# Altium schematic sheet nm_rs485_phy.SchDoc
size 209 x 297 mm; SheetNumber: 3; SheetTotal: 9
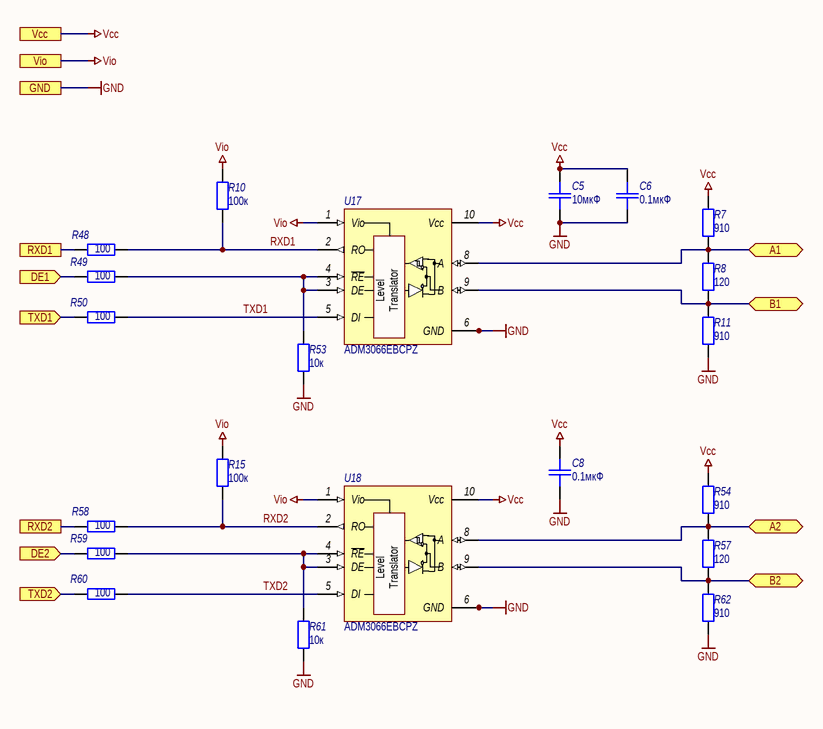
[diagram p0: nm_rs485_phy.SchDoc]

## Parts
C5  value 10мкФ  [SMD_C0603]  (hidden comment: Capacitor)
C6  value 0.1мкФ  [SMD_C0603]  (hidden comment: Capacitor)
C8  value 0.1мкФ  [SMD_C0603]  (hidden comment: Capacitor)
R7  value 910  [SMD_0603]  (hidden comment: Resistor)
R8  value 120  [SMD_0603]  (hidden comment: Resistor)
R10  value 100к  [SMD_0603]  (hidden comment: Resistor)
R11  value 910  [SMD_0603]  (hidden comment: Resistor)
R15  value 100к  [SMD_0603]  (hidden comment: Resistor)
R48  value 100  [SMD_0603]  (hidden comment: Resistor)
R49  value 100  [SMD_0603]  (hidden comment: Resistor)
R50  value 100  [SMD_0603]  (hidden comment: Resistor)
R53  value 10к  [SMD_0603]  (hidden comment: Resistor)
R54  value 910  [SMD_0603]  (hidden comment: Resistor)
R57  value 120  [SMD_0603]  (hidden comment: Resistor)
R58  value 100  [SMD_0603]  (hidden comment: Resistor)
R59  value 100  [SMD_0603]  (hidden comment: Resistor)
R60  value 100  [SMD_0603]  (hidden comment: Resistor)
R61  value 10к  [SMD_0603]  (hidden comment: Resistor)
R62  value 910  [SMD_0603]  (hidden comment: Resistor)
U17  ADM3066EBCPZ  [LFCSP-10_3x3]
U18  ADM3066EBCPZ  [LFCSP-10_3x3]

## Ports
A1 (bidir), A2 (bidir), B1 (bidir), B2 (bidir), DE1 (in), DE2 (in), GND, RXD1, RXD2, TXD1 (in), TXD2 (in), Vcc, Vio

## Nets
GND: C5.1 C6.1 C8.1 R11.1 R53.1 R61.1 R62.1 U17.6(GND) U17.11(GND) U18.6(GND) U18.11(GND) ; port GND
Vcc: C5.2 C6.2 C8.2 R7.1 R54.1 U17.10(Vcc) U18.10(Vcc) ; port Vcc
Vio: R10.1 R15.1 U17.1(Vio) U18.1(Vio) ; port Vio
A1: R7.2 R8.2 U17.8(A) ; port A1
A2: R54.2 R57.2 U18.8(A) ; port A2
B1: R8.1 R11.2 U17.9(B) ; port B1
B2: R57.1 R62.2 U18.9(B) ; port B2
DE1: R49.2 ; port DE1
DE2: R59.2 ; port DE2
RXD1: R10.2 R48.1 U17.2(RO)
RXD1: R48.2 ; port RXD1  [a separate net that carries the same name]
RXD2: R15.2 R58.1 U18.2(RO)
RXD2: R58.2 ; port RXD2  [a separate net that carries the same name]
TXD1: R50.1 U17.5(DI)
TXD1: R50.2 ; port TXD1  [a separate net that carries the same name]
TXD2: R60.1 U18.5(DI)
TXD2: R60.2 ; port TXD2  [a separate net that carries the same name]
NetR49_1: R49.1 R53.2 U17.3(DE) U17.4(~{RE})
NetR59_1: R59.1 R61.2 U18.3(DE) U18.4(~{RE})

## Notes on the sheet
- Подп. и дата
- Инв. № дубл.
- Взам. инв. №
- Инв. № подл.
- Изм.
- Лист
- № докум.
- Подп.
- Дата
- Форма 2а ГОСТ 2.104-2006
- Копировал
- Формат А4
- (in symbol ADM3066E) Level; Translator

## Library data of the parts
C5 C6 C8 = Capacitor: Назначение: SMD-конденсатор; Наименование: Конденсатор; Потребление, Вт: 0; Точность: %; Напряжение: В; Диэлектрик: *; Place_v1: *; Place_v2: *
R7 R8 R10 R11 R15 R48-R50 R53 R54 R57-R62 = Resistor: Наименование: Резистор; Назначение: SMD-резистор; Потребление, Вт: 0,001; Точность: %; Place_v1: *; Place_v2: *
U17 U18 = ADM3066E: 3.0 V to 5.5 V, ±12 kV IEC ESD Protected, 500 kbps/50 Mbps RS-485 Transceiver; Потребление, Вт: 0,1; Наименование: ADM3066EBCPZ; Назначение: RS-485 Transceiver; Place_v1: =PL_RS_PLACE; Place_v2: =PL_RS_PLACE